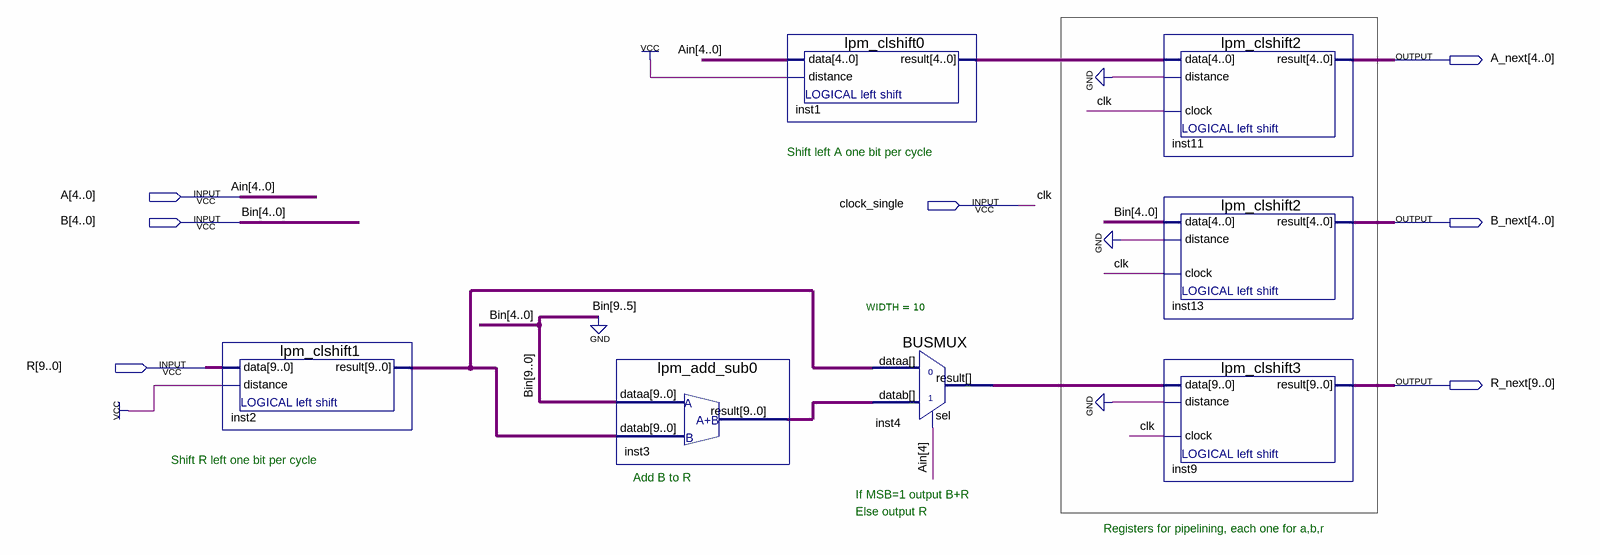
[diagram p0: schematic sheet]
// Quartus schematic multiplier.bdf as structural Verilog: 7 symbols, 7 pins
module multiplier (
  input  [4:0] A,
  input  clock_single,
  input  [4:0] B,
  input  [9:0] R,
  output [4:0] A_next,
  output [4:0] B_next,
  output [9:0] R_next
);

  wire [4:0] inst1_result;
  wire [9:0] inst2_result, inst3_result, inst4_result;

  lpm_clshift1 inst2 (.data(R), .distance(1'b1), .result(inst2_result));
  lpm_add_sub0 inst3 (.dataa({{5{1'b0}}, B}), .datab(inst2_result), .result(inst3_result));
  lpm_clshift0 inst1 (.data(A), .distance(1'b1), .result(inst1_result));
  BUSMUX #(.WIDTH(10)) inst4 (.datab(inst3_result), .sel(A[4]), .dataa(inst2_result), .result(inst4_result));
  lpm_clshift2 inst11 (.data(inst1_result), .distance(1'b0), .clock(clock_single), .result(A_next));
  lpm_clshift2 inst13 (.data(B), .distance(1'b0), .clock(clock_single), .result(B_next));
  lpm_clshift3 inst9 (.data(inst4_result), .distance(1'b0), .clock(clock_single), .result(R_next));

  // Other names for the same wires on the sheet: Ain[4:0] = A; Bin[4:0] = B; clk = clock_single

  // Notes on the sheet:
  //   Shift left A one bit per cycle
  //   Shift R left one bit per cycle
  //   Add B to R
  //   If MSB=1 output B+R
  //   Else output R
  //   Registers for pipelining, each one for a,b,r
endmodule
